# EAGLE schematic Shematic_1 (EAGLE 7.5.0)
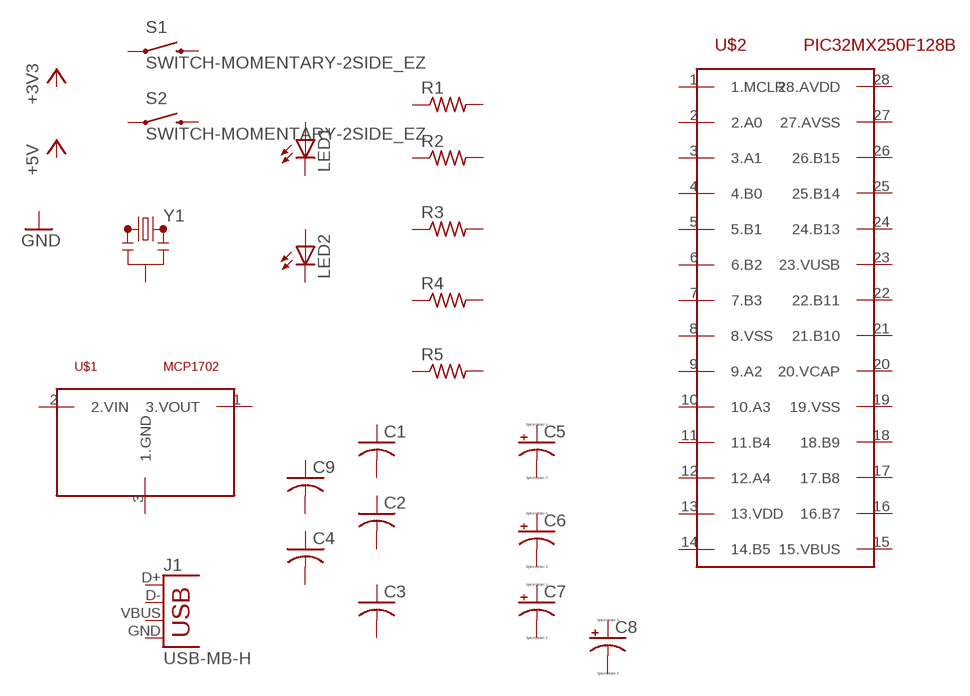
[diagram p0: schematic, sheet 1]

## Parts
C1  C-US025-025X050  [C025-025X050]
C2  C-US025-025X050  [C025-025X050]
C3  C-US025-025X050  [C025-025X050]
C4  C-US025-025X050  [C025-025X050]
C5  CPOL-USTAP5-60  [TAP5-60]
C6  CPOL-USTAP5-60  [TAP5-60]
C7  CPOL-USTAP5-60  [TAP5-60]
C8  CPOL-USTAP5-60  [TAP5-60]
C9  C-US025-025X050  [C025-025X050]
J1  USB-MB-H  [USB-MB-H]
LED1  LED3MM  [LED3MM]
LED2  LED3MM  [LED3MM]
R1  R-US_0207/10  [0207/10]
R2  R-US_0207/10  [0207/10]
R3  R-US_0207/10  [0207/10]
R4  R-US_0207/10  [0207/10]
R5  R-US_0207/10  [0207/10]
S1  SWITCH-MOMENTARY-2SIDE_EZ  [TACTILE-PTH-SIDEEZ]
S2  SWITCH-MOMENTARY-2SIDE_EZ  [TACTILE-PTH-SIDEEZ]
U$1  MCP1702  [TO92]
U$2  PIC32MX250F128B  [DIL28-3]
Y1  RESONATORPTH  [RESONATOR-PTH]
Unconnected: C1.1 C1.2 C2.1 C2.2 C3.1 C3.2 C4.1 C4.2 C5.+ C5.- C6.+ C6.- C7.+ C7.- C8.+ C8.- C9.1 C9.2 J1.D+ J1.D- J1.GND J1.VBUS LED1.A LED1.K(C) LED2.A LED2.K(C) R1.1 R1.2 R2.1 R2.2 R3.1 R3.2 R4.1 R4.2 R5.1 R5.2 S1.1 S1.2 S2.1 S2.2 U$1.1(3.VOUT) U$1.2(2.VIN) U$1.3(1.GND) U$2.1(1.MCLR) U$2.2(2.A0) U$2.3(3.A1) U$2.4(4.B0) U$2.5(5.B1) U$2.6(6.B2) U$2.7(7.B3) U$2.8(8.VSS) U$2.9(9.A2) U$2.10(10.A3) U$2.11(11.B4) U$2.12(12.A4) U$2.13(13.VDD) U$2.14(14.B5) U$2.15(15.VBUS) U$2.16(16.B7) U$2.17(17.B8) U$2.18(18.B9) U$2.19(19.VSS) U$2.20(20.VCAP) U$2.21(21.B10) U$2.22(22.B11) U$2.23(23.VUSB) U$2.24(24.B13) U$2.25(25.B14) U$2.26(26.B15) U$2.27(27.AVSS) U$2.28(28.AVDD) Y1.1 Y1.2 Y1.3

## Library data of the parts
C1-C4 C9 = ME 433 PCB lib:C-US: CAPACITOR, American symbol
C5-C8 = ME 433 PCB lib:CPOL-US: POLARIZED CAPACITOR, American symbol
J1 = ME 433 PCB lib:USB: USB Connectors USB-B-PTH is fully proven SKU : PRT-00139/CONN-08278 USB-miniB is fully proven SKU : PRT-00587 USB-A-PCB is untested. USB-A-H is throughly reviewed, but untested. Spark Fun Electronics SKU : PRT-00437 USB-B-SMT is throughly reviewed, but untested. Needs silkscreen touching up. USB-A-S has not been used/tested USB-MB-H has not been used/tested USB-MICROB has been used. CONN-09505
LED1 LED2 = ME 433 PCB lib:LED: LED OSRAM: - CHIPLED LG R971, LG N971, LY N971, LG Q971, LY Q971, LO R971, LY R971 LH N974, LH R974 LS Q976, LO Q976, LY Q976 LO Q996 - Hyper CHIPLED LW Q18S LB Q993, LB Q99A, LB R99A - SideLED LS A670, LO A670, LY A670, LG A670, LP A670 LB A673, LV A673, LT A673, LW A673 LH A674 LY A675 LS A676, LA A676, LO A676, LY A676, LW A676 LS A679, LY A679, LG A679 - Hyper Micro SIDELED® LS Y876, LA Y876, LO Y876, LY Y876 LT Y87S - SmartLED LW L88C, LW L88S LB L89C, LB L89S, LG L890 LS L89K, LO L89K, LY L89K LS L896, LA L896, LO L896, LY L896 - TOPLED LS T670, LO T670, LY T670, LG T670, LP T670 LSG T670, LSP T670, LSY T670, LOP T670, LYG T670 LG T671, LOG T671, LSG T671 LB T673, LV T673, LT T673, LW T673 LH T674 LS T676, LA T676, LO T676, LY T676, LB T676, LH T676, LSB T676, LW T676 LB T67C, LV T67C, LT T67C, LS T67K, LO T67K, LY T67K, LW E67C LS E67B, LA E67B, LO E67B, LY E67B, LB E67C, LV E67C, LT E67C LW T67C LS T679, LY T679, LG T679 LS T770, LO T770, LY T770, LG T770, LP T770 LB T773, LV T773, LT T773, LW T773 LH T774 LS E675, LA E675, LY E675, LS T675 LS T776, LA T776, LO T776, LY T776, LB T776 LHGB T686 LT T68C, LB T68C - Hyper Mini TOPLED® LB M676 - Mini TOPLED Santana® LG M470 LS M47K, LO M47K, LY M47K Source: http://www.osram.convergy.de LUXEON: - LUMILED® LXK2-PW12-R00, LXK2-PW12-S00, LXK2-PW14-U00, LXK2-PW14-V00 LXK2-PM12-R00, LXK2-PM12-S00, LXK2-PM14-U00 LXK2-PE12-Q00, LXK2-PE12-R00, LXK2-PE12-S00, LXK2-PE14-T00, LXK2-PE14-U00 LXK2-PB12-K00, LXK2-PB12-L00, LXK2-PB12-M00, LXK2-PB14-N00, LXK2-PB14-P00, LXK2-PB14-Q00 LXK2-PR12-L00, LXK2-PR12-M00, LXK2-PR14-Q00, LXK2-PR14-R00 LXK2-PD12-Q00, LXK2-PD12-R00, LXK2-PD12-S00 LXK2-PH12-R00, LXK2-PH12-S00 LXK2-PL12-P00, LXK2-PL12-Q00, LXK2-PL12-R00 Source: www.luxeon.com KINGBRIGHT: KA-3528ASYC Source: www.kingbright.com
R1-R5 = ME 433 PCB lib:R-US_: RESISTOR, American symbol
S1 S2 = ME 433 PCB lib:SWITCH-MOMENTARY-2: Various NO switches- pushbuttons, reed, etc
U$1 = ME 433 PCB lib:MCP1702
U$2 = ME 433 PCB lib:PIC32MX250F128B
Y1 = ME 433 PCB lib:RESONATOR: Resonator Small SMD resonator. Used, eg, on the Arduino Pro/ Pro Mini boards. 8MHz- XTAL-08895 16MHz- XTAL-08900